# Altium project tourelle_commande.PrjPcb
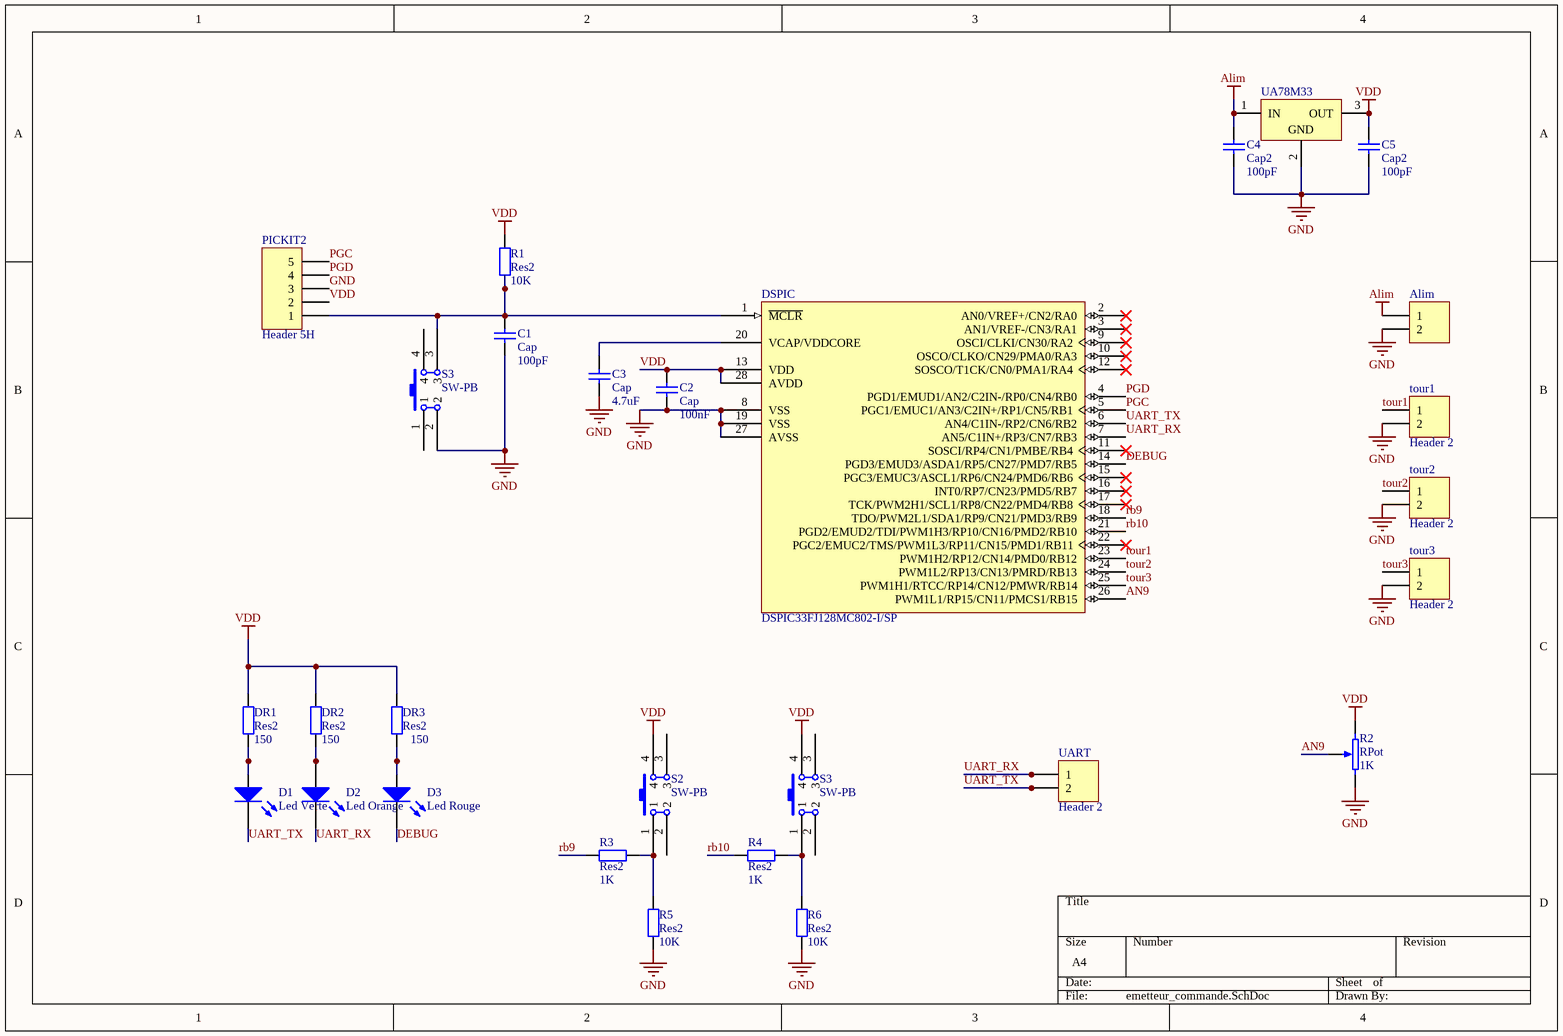
[diagram p0: emetteur_commande.SchDoc]
1 sheet, 28 parts. Net scope: global (net labels, ports and power ports of the same name join across sheets).
Board file: pcb_emmeteur.PcbDoc

## Sheet emetteur_commande.SchDoc
size A4

### Parts
(Parts that share a designator on the sheet are numbered #1, #2 ... from top to bottom, then left to right.)
Alim  Header 2  [HDR1X2]  (value not drawn)
C1  Cap  value 100pF  [RAD-0.3]
C2  Cap  value 100nF  [RAD-0.3]
C3  Cap  value 4.7uF  [RAD-0.3]
C4  Cap2  value 100pF  [CAPA2]
C5  Cap2  value 100pF  [CAPA2]
D1  Led Verte  [LED]
D2  Led Orange  [LED]
D3  Led Rouge  [LED]
DR1  Res2  value 150  [AXIAL-0.4]
DR2  Res2  value 150  [AXIAL-0.4]
DR3  Res2  value 150  [AXIAL-0.4]
DSPIC  DSPIC33FJ128MC802-I/SP  [SPDIP300-SP28]
PICKIT2  Header 5H  [HDR1X5]
R1  Res2  value 10K  [AXIAL-0.4]
R2  RPot  value 1K  [AJUSTABLE]
R3  Res2  value 1K  [AXIAL-0.4]
R4  Res2  value 1K  [AXIAL-0.4]
R5  Res2  value 10K  [AXIAL-0.4]
R6  Res2  value 10K  [AXIAL-0.4]
S2  SW-PB  [SW_BP]
S3#1  SW-PB  [SW_BP]
S3#2  SW-PB  [SW_BP]
tour1  Header 2  [HDR1X2]
tour2  Header 2  [HDR1X2]
tour3  Header 2  [HDR1X2]
UA78M33  LM7805CT  [TO220]  (value not drawn)
UART  Header 2  [HDR1X2]

### Nets
Alim: Alim.1 C4.2 UA78M33.1(IN)
GND: Alim.2 C1.1 C2.1 C3.1 C4.1 C5.1 DSPIC.8(VSS) DSPIC.19(VSS) DSPIC.27(AVSS) PICKIT2.3 R2.1(BOT) R5.1 R6.1 S3#1.2 tour1.2 tour2.2 tour3.2 UA78M33.2(GND)
VDD: C2.2 C5.2 DR1.2 DR2.2 DR3.2 DSPIC.13(VDD) DSPIC.28(AVDD) PICKIT2.2 R1.2 R2.3(TOP) S2.4 S3#2.4 UA78M33.3(OUT)
AN9: DSPIC.26(PWM1L1/RP15/CN11/PMCS1/RB15) R2.2(TAP)
DEBUG: D3.2(K) DSPIC.14(PGD3/EMUD3/ASDA1/RP5/CN27/PMD7/RB5)
PGC: DSPIC.5(PGC1/EMUC1/AN3/C2IN+/RP1/CN5/RB1) PICKIT2.5
PGD: DSPIC.4(PGD1/EMUD1/AN2/C2IN-/RP0/CN4/RB0) PICKIT2.4
rb9: DSPIC.18(TDO/PWM2L1/SDA1/RP9/CN21/PMD3/RB9) R3.1
rb10: DSPIC.21(PGD2/EMUD2/TDI/PWM1H3/RP10/CN16/PMD2/RB10) R4.1
tour1: DSPIC.23(PWM1H2/RP12/CN14/PMD0/RB12) tour1.1
tour2: DSPIC.24(PWM1L2/RP13/CN13/PMRD/RB13) tour2.1
tour3: DSPIC.25(PWM1H1/RTCC/RP14/CN12/PMWR/RB14) tour3.1
UART_RX: D2.2(K) DSPIC.7(AN5/C1IN+/RP3/CN7/RB3) UART.1
UART_TX: D1.2(K) DSPIC.6(AN4/C1IN-/RP2/CN6/RB2) UART.2
NetC1_2: C1.2 DSPIC.1(~{MCLR}) PICKIT2.1 R1.1 S3#1.3
NetC3_2: C3.2 DSPIC.20(VCAP/VDDCORE)
NetD1_1: D1.1(A) DR1.1
NetD2_1: D2.1(A) DR2.1
NetD3_1: D3.1(A) DR3.1
NetR3_2: R3.2 R5.2 S2.1
NetR4_2: R4.2 R6.2 S3#2.1

Not connected (* = marked no-connect by the designer): DSPIC 2(AN0/VREF+/CN2/RA0)* 3(AN1/VREF-/CN3/RA1)* 9(OSCI/CLKI/CN30/RA2)* 10(OSCO/CLKO/CN29/PMA0/RA3)* 11(SOSCI/RP4/CN1/PMBE/RB4)* 12(SOSCO/T1CK/CN0/PMA1/RA4)* 15(PGC3/EMUC3/ASCL1/RP6/CN24/PMD6/RB6)* 16(INT0/RP7/CN23/PMD5/RB7)* 17(TCK/PWM2H1/SCL1/RP8/CN22/PMD4/RB8)* 22(PGC2/EMUC2/TMS/PWM1L3/RP11/CN15/PMD1/RB11)*; S2 2 3; S3#1 1 4; S3#2 2 3

### Library data of the parts
Alim tour1-tour3 UART = Header 2: Header, 2-Pin; LatestRevisionDate: 17-Jul-2002; LatestRevisionNote: Re-released for DXP Platform.; Publisher: Altium Limited
C1-C3 = Cap: Capacitor; Published: 8-Jun-2000; LatestRevisionDate: 17-Jul-2002; LatestRevisionNote: Re-released for DXP Platform.; PackageReference: RAD-0.3; Publisher: Altium Limited; PackageDescription: Radial Cap, Thru-Hole; 2 Leads; 0.3 in Pin Spacing
C4 C5 = Cap2: Capacitor; Published: 8-Jun-2000; LatestRevisionDate: 17-Jul-2002; LatestRevisionNote: Re-released for DXP Platform.; PackageReference: RAD-0.3; Publisher: Altium Limited
D1-D3 = Led: Published: 8-Jun-2000; LatestRevisionDate: 17-Jul-2002; LatestRevisionNote: Re-released for DXP Platform.; DatasheetDocument: 1998; PackageDocument: Aug-1999; PackageReference: DO-41; Publisher: Altium Limited; Code_JEDEC: DO-204-AL; ComponentLink1Description: Manufacturer Link; ComponentLink1URL: http://www.fairchildsemi.com/; ComponentLink2Description: Datasheet; ComponentLink2URL: http://www.fairchildsemi.com/ds/1N%2F1N4001.pdf
DR1-DR3 R1 R3-R6 = Res2: Resistor; Published: 8-Jun-2000; LatestRevisionDate: 17-Jul-2002; LatestRevisionNote: Re-released for DXP Platform.; PackageReference: AXIAL-0.4; Publisher: Altium Limited; PackageDescription: Axial Device, Thru-Hole; 2 Leads; 0.4 in Pin Spacing
DSPIC = DSPIC33FJ128MC802-I/SP: High-Performance 16-bit Digital Signal Controller, 128 KB Flash, 16 KB RAM, 28-Pin SPDIP, Industrial Temperature; Published: 29-Jan-2009; DatasheetVersion: revB, Mar-2008; PackageVersion: revAW, Oct-2008; PackageReference: SPDIP300-SP28; Publisher: Altium Limited; PackageDescription: 28-Lead Skinny Plastic Dual In-Line (SP) - 300 mil Body [SPDIP]; ComponentLink1Description: Manufacturer Link; ComponentLink1URL: http://www.microchip.com; ComponentLink2Description: Datasheet; ComponentLink2URL: http://ww1.microchip.com/downloads/en/DeviceDoc/70291B.pdf; ComponentLink3Description: Packaging Specification; ComponentLink3URL: http://ww1.microchip.com/downloads/en/PackagingSpec/00049AW.pdf
PICKIT2 = Header 5H: Header, 5-Pin, Right Angle; LatestRevisionDate: 17-Jul-2002; LatestRevisionNote: Re-released for DXP Platform.; Publisher: Altium Limited
R2 = RPot: Potentiometer; Sim Note: Enter the Resistance value and the set point into parameter fields.; Set Position: 0.5; Published: 8-Jun-2000; LatestRevisionDate: 17-Jul-2002; LatestRevisionNote: Re-released for DXP Platform.; PackageReference: VR5; Publisher: Altium Limited
S2 S3#1 S3#2 = SW-PB: Switch; Published: 24-Mar-1999; LatestRevisionDate: 17-Jul-2002; LatestRevisionNote: Re-released for DXP Platform.; PackageReference: SPST-2; Publisher: Altium Limited
UA78M33 = LM7805CT: Series 3-Terminal Positive Regulator; Note: Tab is connected to GND; Published: 15-Apr-2002; DatasheetVersion: May-1999; PackageVersion: 1995; PackageReference: T03B; Publisher: Altium Limited; PackageDescription: TO, Thru-Hole, Vertical, Heatsink Mounted; 3 In-Line Leads; Pitch 2.54 mm; ComponentLink1Description: Manufacturer Link; ComponentLink1URL: http://www.national.com/; ComponentLink2Description: Datasheet; ComponentLink2URL: http://www.national.com/ds.cgi/LM/LM7512C.pdf; ComponentLink3Description: URL Link1; ComponentLink3URL: http://www.national.com/pf/LM/LM7805C.html